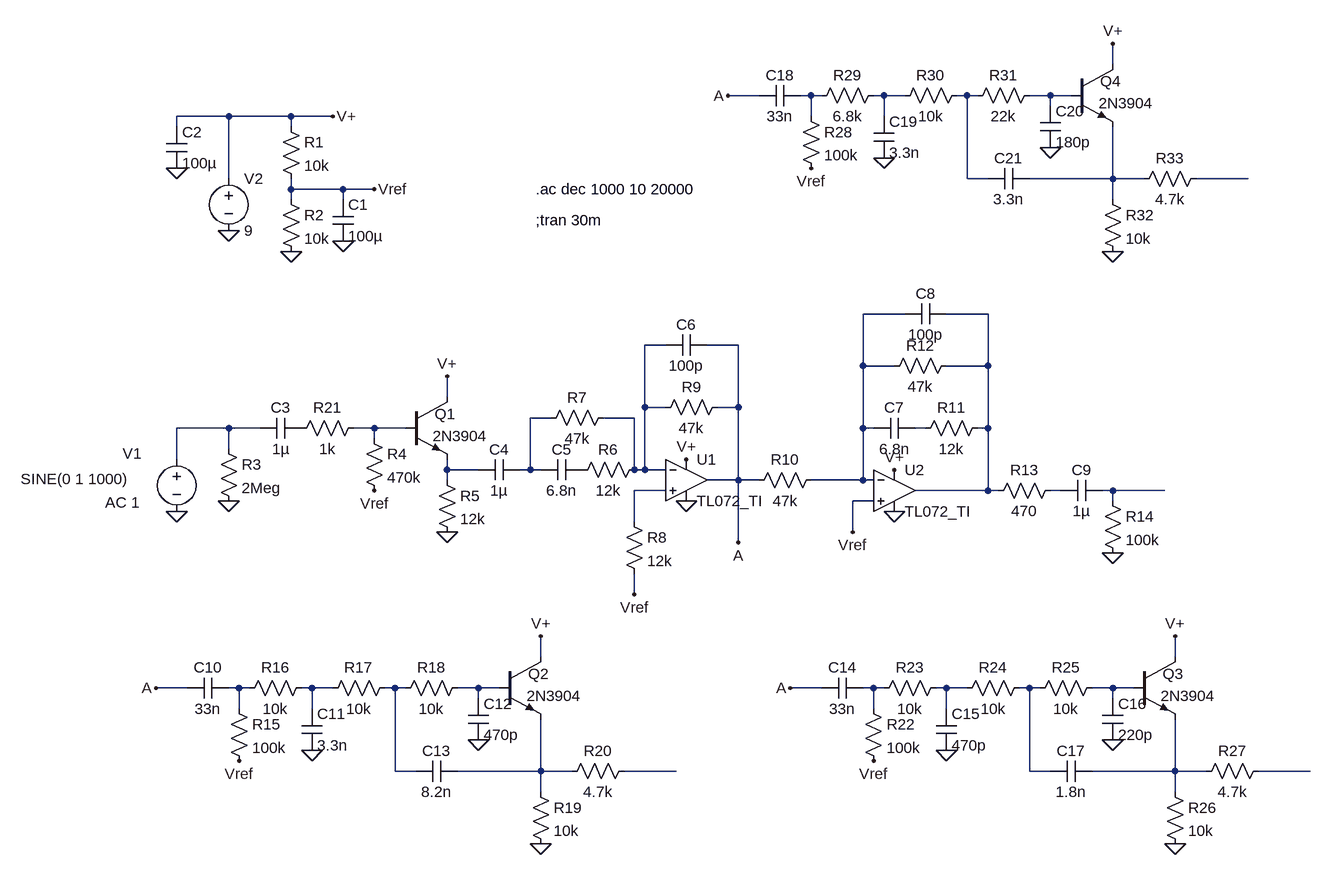
[diagram p0: schematic boss ceb-2 variations.asc]
boss ceb-2 variations.asc, the LTspice schematic file:
Version 4
SHEET 1 2260 864
WIRE 1536 -432 1536 -464
WIRE 992 -384 944 -384
WIRE 1072 -384 1056 -384
WIRE 1088 -384 1072 -384
WIRE 1184 -384 1168 -384
WIRE 1216 -384 1184 -384
WIRE 1312 -384 1296 -384
WIRE 1328 -384 1312 -384
WIRE 1440 -384 1408 -384
WIRE 1472 -384 1440 -384
WIRE 1440 -368 1440 -384
WIRE 176 -352 96 -352
WIRE 272 -352 176 -352
WIRE 336 -352 272 -352
WIRE 1072 -352 1072 -384
WIRE 1184 -352 1184 -384
WIRE 96 -336 96 -352
WIRE 272 -336 272 -352
WIRE 176 -256 176 -352
WIRE 1312 -256 1312 -384
WIRE 1344 -256 1312 -256
WIRE 1536 -256 1536 -336
WIRE 1536 -256 1408 -256
WIRE 1584 -256 1536 -256
WIRE 1744 -256 1664 -256
WIRE 272 -240 272 -256
WIRE 352 -240 272 -240
WIRE 400 -240 352 -240
WIRE 272 -224 272 -240
WIRE 352 -224 352 -240
WIRE 1536 -224 1536 -256
WIRE 1216 -48 1152 -48
WIRE 1344 -48 1280 -48
WIRE 848 0 816 0
WIRE 960 0 912 0
WIRE 1152 32 1152 -48
WIRE 1200 32 1152 32
WIRE 1344 32 1344 -48
WIRE 1344 32 1280 32
WIRE 512 80 512 48
WIRE 816 96 816 0
WIRE 848 96 816 96
WIRE 960 96 960 0
WIRE 960 96 928 96
WIRE 672 112 640 112
WIRE 800 112 752 112
WIRE 176 128 96 128
WIRE 224 128 176 128
WIRE 400 128 368 128
WIRE 448 128 400 128
WIRE 1152 128 1152 32
WIRE 1168 128 1152 128
WIRE 1248 128 1232 128
WIRE 1344 128 1344 32
WIRE 1344 128 1328 128
WIRE 400 144 400 128
WIRE 176 160 176 128
WIRE 96 176 96 128
WIRE 512 192 512 176
WIRE 560 192 512 192
WIRE 640 192 640 112
WIRE 640 192 624 192
WIRE 656 192 640 192
WIRE 800 192 800 112
WIRE 816 192 816 96
WIRE 816 192 800 192
WIRE 848 192 816 192
WIRE 512 208 512 192
WIRE 960 208 960 96
WIRE 960 208 912 208
WIRE 992 208 960 208
WIRE 1152 208 1152 128
WIRE 1152 208 1072 208
WIRE 1168 208 1152 208
WIRE 848 224 800 224
WIRE 1344 224 1344 128
WIRE 1344 224 1232 224
WIRE 1360 224 1344 224
WIRE 1456 224 1440 224
WIRE 1536 224 1520 224
WIRE 1616 224 1536 224
WIRE 1168 240 1136 240
WIRE 1536 240 1536 224
WIRE 800 272 800 224
WIRE 1136 288 1136 240
WIRE 960 304 960 208
WIRE 800 384 800 352
WIRE 656 480 656 448
WIRE 1632 480 1632 448
WIRE 112 528 64 528
WIRE 192 528 176 528
WIRE 208 528 192 528
WIRE 304 528 288 528
WIRE 336 528 304 528
WIRE 432 528 416 528
WIRE 448 528 432 528
WIRE 560 528 528 528
WIRE 592 528 560 528
WIRE 1088 528 1040 528
WIRE 1168 528 1152 528
WIRE 1184 528 1168 528
WIRE 1280 528 1264 528
WIRE 1312 528 1280 528
WIRE 1408 528 1392 528
WIRE 1424 528 1408 528
WIRE 1536 528 1504 528
WIRE 1568 528 1536 528
WIRE 560 544 560 528
WIRE 1536 544 1536 528
WIRE 192 560 192 528
WIRE 304 560 304 528
WIRE 1168 560 1168 528
WIRE 1280 560 1280 528
WIRE 432 656 432 528
WIRE 464 656 432 656
WIRE 656 656 656 576
WIRE 656 656 528 656
WIRE 704 656 656 656
WIRE 864 656 784 656
WIRE 1408 656 1408 528
WIRE 1440 656 1408 656
WIRE 1632 656 1632 576
WIRE 1632 656 1504 656
WIRE 1680 656 1632 656
WIRE 1840 656 1760 656
WIRE 656 688 656 656
WIRE 1632 688 1632 656
FLAG 96 256 0
FLAG 176 -176 0
FLAG 272 -144 0
FLAG 96 -272 0
FLAG 352 -160 0
FLAG 336 -352 V+
FLAG 400 -240 Vref
FLAG 512 48 V+
FLAG 176 240 0
FLAG 512 288 0
FLAG 880 176 V+
FLAG 880 240 0
FLAG 800 384 Vref
FLAG 1200 192 V+
FLAG 1200 256 0
FLAG 1136 288 Vref
FLAG 1536 320 0
FLAG 400 224 Vref
FLAG 560 608 0
FLAG 656 768 0
FLAG 304 624 0
FLAG 192 640 Vref
FLAG 656 448 V+
FLAG 64 528 A
FLAG 960 304 A
FLAG 1536 608 0
FLAG 1632 768 0
FLAG 1280 624 0
FLAG 1168 640 Vref
FLAG 1632 448 V+
FLAG 1040 528 A
FLAG 1440 -304 0
FLAG 1536 -144 0
FLAG 1184 -288 0
FLAG 1072 -272 Vref
FLAG 1536 -464 V+
FLAG 944 -384 A
SYMBOL voltage 96 160 R0
WINDOW 0 -83 7 Left 2
WINDOW 3 -240 46 Left 2
WINDOW 123 -110 82 Left 2
WINDOW 39 0 0 Left 2
SYMATTR InstName V1
SYMATTR Value SINE(0 1 1000)
SYMATTR Value2 AC 1
SYMBOL voltage 176 -272 R0
WINDOW 123 0 0 Left 2
WINDOW 39 0 0 Left 2
SYMATTR InstName V2
SYMATTR Value 9
SYMBOL res 256 -352 R0
SYMATTR InstName R1
SYMATTR Value 10k
SYMBOL res 256 -240 R0
SYMATTR InstName R2
SYMATTR Value 10k
SYMBOL cap 336 -224 R0
SYMATTR InstName C1
SYMATTR Value 100µ
SYMBOL cap 80 -336 R0
SYMATTR InstName C2
SYMATTR Value 100µ
SYMBOL EXTRA\\AudioOpamp\\TI\\TL072_TI 880 208 R0
SYMATTR InstName U1
SYMBOL EXTRA\\AudioOpamp\\TI\\TL072_TI 1200 224 R0
SYMATTR InstName U2
SYMBOL res 160 144 R0
SYMATTR InstName R3
SYMATTR Value 2Meg
SYMBOL cap 288 112 R90
WINDOW 0 0 32 VBottom 2
WINDOW 3 32 32 VTop 2
SYMATTR InstName C3
SYMATTR Value 1µ
SYMBOL res 384 128 R0
SYMATTR InstName R4
SYMATTR Value 470k
SYMBOL npn 448 80 R0
WINDOW 0 45 26 Left 2
WINDOW 3 42 60 Left 2
SYMATTR InstName Q1
SYMATTR Value 2N3904
SYMBOL res 496 192 R0
SYMATTR InstName R5
SYMATTR Value 12k
SYMBOL cap 624 176 R90
WINDOW 0 0 32 VBottom 2
WINDOW 3 32 32 VTop 2
SYMATTR InstName C4
SYMATTR Value 1µ
SYMBOL cap 720 176 R90
WINDOW 0 0 32 VBottom 2
WINDOW 3 32 32 VTop 2
SYMATTR InstName C5
SYMATTR Value 6.8n
SYMBOL res 816 176 R90
WINDOW 0 0 56 VBottom 2
WINDOW 3 32 56 VTop 2
SYMATTR InstName R6
SYMATTR Value 12k
SYMBOL res 768 96 R90
WINDOW 0 0 56 VBottom 2
WINDOW 3 32 56 VTop 2
SYMATTR InstName R7
SYMATTR Value 47k
SYMBOL res 784 256 R0
SYMATTR InstName R8
SYMATTR Value 12k
SYMBOL res 944 80 R90
WINDOW 0 0 56 VBottom 2
WINDOW 3 32 56 VTop 2
SYMATTR InstName R9
SYMATTR Value 47k
SYMBOL cap 912 -16 R90
WINDOW 0 0 32 VBottom 2
WINDOW 3 32 32 VTop 2
SYMATTR InstName C6
SYMATTR Value 100p
SYMBOL res 1088 192 R90
WINDOW 0 0 56 VBottom 2
WINDOW 3 32 56 VTop 2
SYMATTR InstName R10
SYMATTR Value 47k
SYMBOL cap 1232 112 R90
WINDOW 0 0 32 VBottom 2
WINDOW 3 32 32 VTop 2
SYMATTR InstName C7
SYMATTR Value 6.8n
SYMBOL res 1344 112 R90
WINDOW 0 0 56 VBottom 2
WINDOW 3 32 56 VTop 2
SYMATTR InstName R11
SYMATTR Value 12k
SYMBOL res 1296 16 R90
WINDOW 0 0 56 VBottom 2
WINDOW 3 32 56 VTop 2
SYMATTR InstName R12
SYMATTR Value 47k
SYMBOL cap 1280 -64 R90
WINDOW 0 0 32 VBottom 2
WINDOW 3 32 32 VTop 2
SYMATTR InstName C8
SYMATTR Value 100p
SYMBOL res 1456 208 R90
WINDOW 0 0 56 VBottom 2
WINDOW 3 32 56 VTop 2
SYMATTR InstName R13
SYMATTR Value 470
SYMBOL cap 1520 208 R90
WINDOW 0 0 32 VBottom 2
WINDOW 3 32 32 VTop 2
SYMATTR InstName C9
SYMATTR Value 1µ
SYMBOL res 1520 224 R0
SYMATTR InstName R14
SYMATTR Value 100k
SYMBOL cap 176 512 R90
WINDOW 0 0 32 VBottom 2
WINDOW 3 32 32 VTop 2
SYMATTR InstName C10
SYMATTR Value 33n
SYMBOL res 176 544 R0
SYMATTR InstName R15
SYMATTR Value 100k
SYMBOL res 304 512 R90
WINDOW 0 0 56 VBottom 2
WINDOW 3 32 56 VTop 2
SYMATTR InstName R16
SYMATTR Value 10k
SYMBOL cap 288 560 R0
SYMATTR InstName C11
SYMATTR Value 3.3n
SYMBOL res 432 512 R90
WINDOW 0 0 56 VBottom 2
WINDOW 3 32 56 VTop 2
SYMATTR InstName R17
SYMATTR Value 10k
SYMBOL res 544 512 R90
WINDOW 0 0 56 VBottom 2
WINDOW 3 32 56 VTop 2
SYMATTR InstName R18
SYMATTR Value 10k
SYMBOL cap 544 544 R0
SYMATTR InstName C12
SYMATTR Value 470p
SYMBOL npn 592 480 R0
WINDOW 0 45 26 Left 2
WINDOW 3 42 60 Left 2
SYMATTR InstName Q2
SYMATTR Value 2N3904
SYMBOL res 640 672 R0
SYMATTR InstName R19
SYMATTR Value 10k
SYMBOL cap 528 640 R90
WINDOW 0 0 32 VBottom 2
WINDOW 3 32 32 VTop 2
SYMATTR InstName C13
SYMATTR Value 8.2n
SYMBOL res 384 112 R90
WINDOW 0 0 56 VBottom 2
WINDOW 3 32 56 VTop 2
SYMATTR InstName R21
SYMATTR Value 1k
SYMBOL res 800 640 R90
WINDOW 0 0 56 VBottom 2
WINDOW 3 32 56 VTop 2
SYMATTR InstName R20
SYMATTR Value 4.7k
SYMBOL cap 1152 512 R90
WINDOW 0 0 32 VBottom 2
WINDOW 3 32 32 VTop 2
SYMATTR InstName C14
SYMATTR Value 33n
SYMBOL res 1152 544 R0
SYMATTR InstName R22
SYMATTR Value 100k
SYMBOL res 1280 512 R90
WINDOW 0 0 56 VBottom 2
WINDOW 3 32 56 VTop 2
SYMATTR InstName R23
SYMATTR Value 10k
SYMBOL cap 1264 560 R0
SYMATTR InstName C15
SYMATTR Value 470p
SYMBOL res 1408 512 R90
WINDOW 0 0 56 VBottom 2
WINDOW 3 32 56 VTop 2
SYMATTR InstName R24
SYMATTR Value 10k
SYMBOL res 1520 512 R90
WINDOW 0 0 56 VBottom 2
WINDOW 3 32 56 VTop 2
SYMATTR InstName R25
SYMATTR Value 10k
SYMBOL cap 1520 544 R0
SYMATTR InstName C16
SYMATTR Value 220p
SYMBOL npn 1568 480 R0
WINDOW 0 45 26 Left 2
WINDOW 3 42 60 Left 2
SYMATTR InstName Q3
SYMATTR Value 2N3904
SYMBOL res 1616 672 R0
SYMATTR InstName R26
SYMATTR Value 10k
SYMBOL cap 1504 640 R90
WINDOW 0 0 32 VBottom 2
WINDOW 3 32 32 VTop 2
SYMATTR InstName C17
SYMATTR Value 1.8n
SYMBOL res 1776 640 R90
WINDOW 0 0 56 VBottom 2
WINDOW 3 32 56 VTop 2
SYMATTR InstName R27
SYMATTR Value 4.7k
SYMBOL cap 1056 -400 R90
WINDOW 0 0 32 VBottom 2
WINDOW 3 32 32 VTop 2
SYMATTR InstName C18
SYMATTR Value 33n
SYMBOL res 1056 -368 R0
SYMATTR InstName R28
SYMATTR Value 100k
SYMBOL res 1184 -400 R90
WINDOW 0 0 56 VBottom 2
WINDOW 3 32 56 VTop 2
SYMATTR InstName R29
SYMATTR Value 6.8k
SYMBOL cap 1168 -352 R0
SYMATTR InstName C19
SYMATTR Value 3.3n
SYMBOL res 1312 -400 R90
WINDOW 0 0 56 VBottom 2
WINDOW 3 32 56 VTop 2
SYMATTR InstName R30
SYMATTR Value 10k
SYMBOL res 1424 -400 R90
WINDOW 0 0 56 VBottom 2
WINDOW 3 32 56 VTop 2
SYMATTR InstName R31
SYMATTR Value 22k
SYMBOL cap 1424 -368 R0
SYMATTR InstName C20
SYMATTR Value 180p
SYMBOL npn 1472 -432 R0
WINDOW 0 45 26 Left 2
WINDOW 3 42 60 Left 2
SYMATTR InstName Q4
SYMATTR Value 2N3904
SYMBOL res 1520 -240 R0
SYMATTR InstName R32
SYMATTR Value 10k
SYMBOL cap 1408 -272 R90
WINDOW 0 0 32 VBottom 2
WINDOW 3 32 32 VTop 2
SYMATTR InstName C21
SYMATTR Value 3.3n
SYMBOL res 1680 -272 R90
WINDOW 0 0 56 VBottom 2
WINDOW 3 32 56 VTop 2
SYMATTR InstName R33
SYMATTR Value 4.7k
TEXT 648 -240 Left 2 !.ac dec 1000 10 20000
TEXT 648 -192 Left 2 !;tran 30m

The netlist it stands for:
* boss ceb-2 variations.asc
V1 N011 0 SINE(0 1 1000) AC 1
V2 V+ 0 9
R1 V+ Vref 10k
R2 Vref 0 10k
C1 Vref 0 100µ
C2 V+ 0 100µ
* U1: TL072_TI (symbol EXTRA\AudioOpamp\TI\TL072_TI not available, pins judged from their places): In+=N015 In-=N009 V+=V+ V-=0 OUT=A
* U2: TL072_TI (symbol EXTRA\AudioOpamp\TI\TL072_TI not available, pins judged from their places): In+=Vref In-=N007 V+=V+ V-=0 OUT=N008
R3 N011 0 2Meg
C3 P001 N011 1µ
R4 N012 Vref 470k
Q1 V+ N012 N014 0 2N3904
R5 N014 0 12k
C4 N010 N014 1µ
C5 P002 N010 6.8n
R6 N009 P002 12k
R7 N009 N010 47k
R8 N015 Vref 12k
R9 A N009 47k
C6 A N009 100p
R10 N007 A 47k
C7 N013 N007 6.8n
R11 N008 N013 12k
R12 N008 N007 47k
C8 N008 N007 100p
R13 N016 N008 470
C9 N017 N016 1µ
R14 N017 0 100k
C10 N018 A 33n
R15 N018 Vref 100k
R16 N019 N018 10k
C11 N019 0 3.3n
R17 N020 N019 10k
R18 N021 N020 10k
C12 N021 0 470p
Q2 V+ N021 N026 0 2N3904
R19 N026 0 10k
C13 N026 N020 8.2n
R21 N012 P001 1k
R20 N027 N026 4.7k
C14 N022 A 33n
R22 N022 Vref 100k
R23 N023 N022 10k
C15 N023 0 470p
R24 N024 N023 10k
R25 N025 N024 10k
C16 N025 0 220p
Q3 V+ N025 N028 0 2N3904
R26 N028 0 10k
C17 N028 N024 1.8n
R27 N029 N028 4.7k
C18 N001 A 33n
R28 N001 Vref 100k
R29 N002 N001 6.8k
C19 N002 0 3.3n
R30 N003 N002 10k
R31 N004 N003 22k
C20 N004 0 180p
Q4 V+ N004 N005 0 2N3904
R32 N005 0 10k
C21 N005 N003 3.3n
R33 N006 N005 4.7k
.model NPN NPN
.model PNP PNP
.lib standard.bjt
.ac dec 1000 10 20000
;tran 30m
.backanno
.end